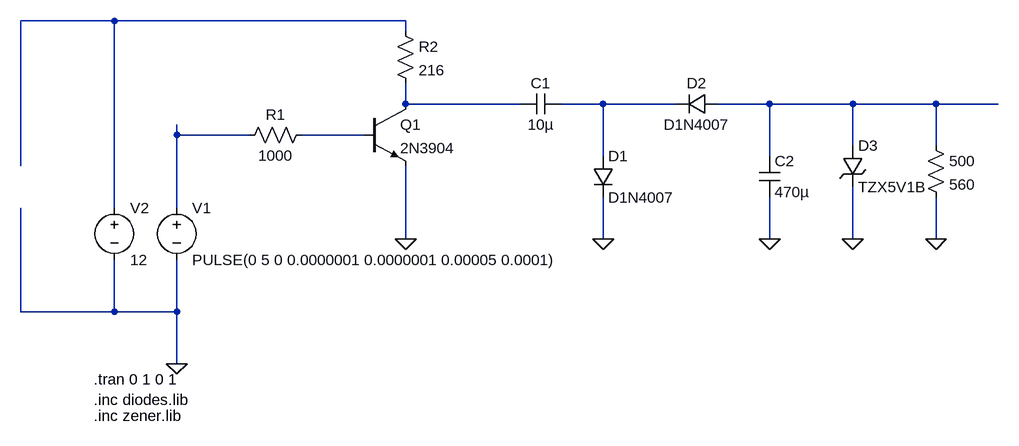
[diagram p0: schematic Draft2.asc]
Draft2.asc, the LTspice schematic file:
Version 4
SHEET 1 1304 680
WIRE -208 -176 -352 -176
WIRE 240 -176 -208 -176
WIRE 240 -160 240 -176
WIRE 240 -48 240 -80
WIRE 416 -48 240 -48
WIRE 544 -48 480 -48
WIRE 656 -48 544 -48
WIRE 800 -48 720 -48
WIRE 928 -48 800 -48
WIRE 1056 -48 928 -48
WIRE 1152 -48 1056 -48
WIRE -112 0 -112 -16
WIRE 0 0 -112 0
WIRE 176 0 80 0
WIRE 928 16 928 -48
WIRE 1056 16 1056 -48
WIRE 544 32 544 -48
WIRE 800 32 800 -48
WIRE -352 48 -352 -176
WIRE -208 112 -208 -176
WIRE -112 112 -112 0
WIRE 240 160 240 48
WIRE 544 160 544 96
WIRE 800 160 800 96
WIRE 928 160 928 80
WIRE 1056 160 1056 96
WIRE -352 272 -352 112
WIRE -208 272 -208 192
WIRE -208 272 -352 272
WIRE -112 272 -112 192
WIRE -112 272 -208 272
WIRE -112 352 -112 272
FLAG -112 352 0
FLAG 240 160 0
FLAG 800 160 0
FLAG 928 160 0
FLAG 1056 160 0
FLAG 544 160 0
SYMBOL voltage -112 96 R0
WINDOW 123 0 0 Left 2
WINDOW 39 0 0 Left 2
SYMATTR InstName V1
SYMATTR Value PULSE(0 5 0 0.0000001 0.0000001 0.00005 0.0001)
SYMBOL voltage -208 96 R0
WINDOW 123 0 0 Left 2
WINDOW 39 0 0 Left 2
SYMATTR InstName V2
SYMATTR Value 12
SYMBOL npn 176 -48 R0
SYMATTR InstName Q1
SYMATTR Value 2N3904
SYMBOL res -16 16 R270
WINDOW 0 32 56 VTop 2
WINDOW 3 0 56 VBottom 2
SYMATTR InstName R1
SYMATTR Value 1000
SYMBOL cap 416 -32 R270
WINDOW 0 32 32 VTop 2
WINDOW 3 0 32 VBottom 2
SYMATTR InstName C1
SYMATTR Value 10µ
SYMBOL diode 528 32 R0
SYMATTR InstName D1
SYMATTR Value D1N4007
SYMBOL diode 720 -64 R90
WINDOW 0 0 32 VBottom 2
WINDOW 3 32 32 VTop 2
SYMATTR InstName D2
SYMATTR Value D1N4007
SYMBOL cap 784 32 R0
SYMATTR InstName C2
SYMATTR Value 470µ
SYMBOL res 1040 0 R0
SYMATTR InstName 500
SYMATTR Value 560
SYMBOL res 224 -176 R0
SYMATTR InstName R2
SYMATTR Value 216
SYMBOL zener 912 16 R0
SYMATTR InstName D3
SYMATTR Value TZX5V1B
TEXT -240 376 Left 2 !.tran 0 1 0 1
TEXT -240 408 Left 2 !.inc diodes.lib
TEXT -240 432 Left 2 !.inc zener.lib

The netlist it stands for:
* Draft2.asc
V1 N005 0 PULSE(0 5 0 0.0000001 0.0000001 0.00005 0.0001)
V2 N001 0 12
Q1 N002 N006 0 0 2N3904
R1 N005 N006 1000
C1 N002 N003 10µ
D1 N003 0 D1N4007
D2 N004 N003 D1N4007
C2 N004 0 470µ
R§500 N004 0 560
R2 N001 N002 216
D3 N004 0 TZX5V1B
.model D D
.lib standard.dio
.model NPN NPN
.model PNP PNP
.lib standard.bjt
.tran 0 1 0 1
.inc diodes.lib
.inc zener.lib
.backanno
.end